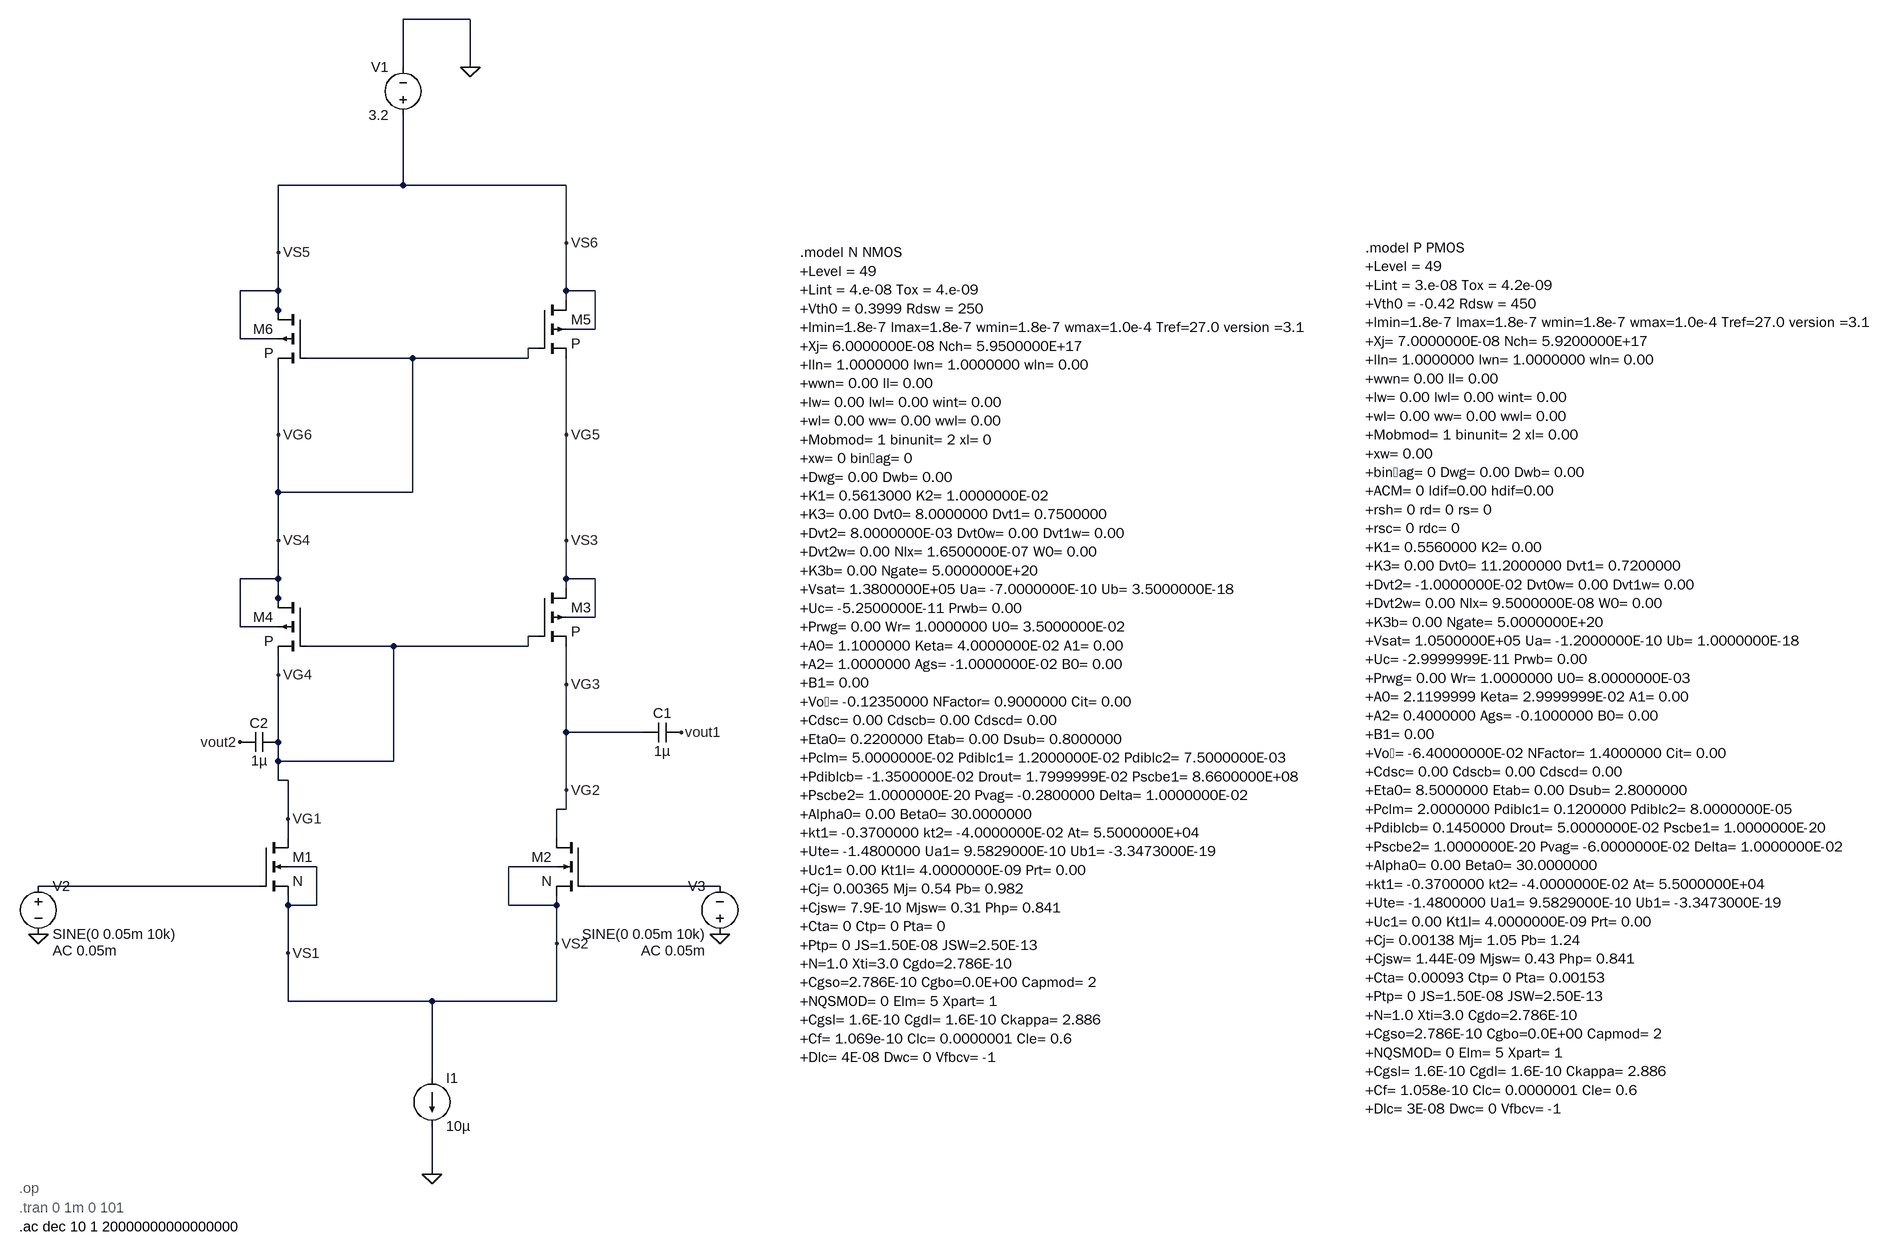
[diagram p0: schematic cascode.asc]
cascode.asc, the LTspice schematic file:
Version 4
SHEET 1 4308 1096
WIRE 1024 -976 912 -976
WIRE 912 -896 912 -976
WIRE 1024 -896 1024 -976
WIRE 912 -656 912 -816
WIRE 912 -656 704 -656
WIRE 1184 -656 912 -656
WIRE 1184 -560 1184 -656
WIRE 704 -544 704 -656
WIRE 704 -480 704 -544
WIRE 704 -480 640 -480
WIRE 1184 -480 1184 -560
WIRE 1232 -480 1184 -480
WIRE 1184 -464 1184 -480
WIRE 704 -448 704 -480
WIRE 704 -432 704 -448
WIRE 1232 -416 1232 -480
WIRE 1232 -416 1184 -416
WIRE 640 -400 640 -480
WIRE 704 -400 640 -400
WIRE 1136 -384 1120 -384
WIRE 928 -368 752 -368
WIRE 1120 -368 1120 -384
WIRE 1120 -368 928 -368
WIRE 704 -240 704 -352
WIRE 1184 -240 1184 -368
WIRE 704 -144 704 -240
WIRE 928 -144 928 -368
WIRE 928 -144 704 -144
WIRE 704 -64 704 -144
WIRE 1184 -64 1184 -240
WIRE 704 0 704 -64
WIRE 704 0 640 0
WIRE 1184 0 1184 -64
WIRE 1232 0 1184 0
WIRE 1184 16 1184 0
WIRE 704 32 704 0
WIRE 704 48 704 32
WIRE 1232 64 1232 0
WIRE 1232 64 1184 64
WIRE 640 80 640 0
WIRE 704 80 640 80
WIRE 1136 96 1120 96
WIRE 896 112 752 112
WIRE 1120 112 1120 96
WIRE 1120 112 896 112
WIRE 704 160 704 128
WIRE 1184 176 1184 112
WIRE 1184 256 1184 176
WIRE 1312 256 1184 256
WIRE 704 272 704 160
WIRE 704 304 704 272
WIRE 896 304 896 112
WIRE 896 304 704 304
WIRE 704 336 704 304
WIRE 720 336 704 336
WIRE 1184 352 1184 256
WIRE 1184 384 1184 352
WIRE 1184 384 1168 384
WIRE 720 400 720 336
WIRE 720 432 720 400
WIRE 1168 432 1168 384
WIRE 768 480 720 480
WIRE 1168 480 1088 480
WIRE 672 512 304 512
WIRE 1440 512 1216 512
WIRE 720 544 720 528
WIRE 768 544 768 480
WIRE 768 544 720 544
WIRE 1088 544 1088 480
WIRE 1168 544 1168 528
WIRE 1168 544 1088 544
WIRE 1168 608 1168 544
WIRE 720 624 720 544
WIRE 720 704 720 624
WIRE 960 704 720 704
WIRE 1168 704 1168 608
WIRE 1168 704 960 704
WIRE 960 832 960 704
WIRE 960 992 960 912
FLAG 960 992 0
FLAG 1024 -896 0
FLAG 304 592 0
FLAG 1440 592 0
FLAG 1376 256 vout1
FLAG 640 272 vout2
FLAG 720 400 VG1
FLAG 1184 352 VG2
FLAG 720 624 VS1
FLAG 1168 608 VS2
FLAG 1184 -64 VS3
FLAG 704 -64 VS4
FLAG 1184 176 VG3
FLAG 704 160 VG4
FLAG 704 -544 VS5
FLAG 1184 -560 VS6
FLAG 1184 -240 VG5
FLAG 704 -240 VG6
SYMBOL nmos4 672 432 R0
SYMATTR InstName M1
SYMATTR Value N
SYMATTR Value2 l=1u w=50u
SYMBOL nmos4 1216 432 M0
SYMATTR InstName M2
SYMATTR Value N
SYMATTR Value2 l=1u w=50u
SYMBOL pmos4 1136 16 R0
SYMATTR InstName M3
SYMATTR Value P
SYMATTR Value2 l=1u w=10u
SYMBOL pmos4 752 32 M0
SYMATTR InstName M4
SYMATTR Value P
SYMATTR Value2 l=1u w=10u
SYMBOL current 960 832 R0
WINDOW 123 0 0 Left 0
WINDOW 39 0 0 Left 0
SYMATTR InstName I1
SYMATTR Value 10µ
SYMBOL voltage 912 -800 R180
WINDOW 0 24 96 Left 2
WINDOW 3 24 16 Left 2
WINDOW 123 0 0 Left 0
WINDOW 39 0 0 Left 0
SYMATTR InstName V1
SYMATTR Value 3.2
SYMBOL cap 1376 240 R90
WINDOW 0 0 32 VBottom 2
WINDOW 3 32 32 VTop 2
SYMATTR InstName C1
SYMATTR Value 1µ
SYMBOL voltage 304 496 R0
WINDOW 123 24 124 Left 2
WINDOW 39 0 0 Left 0
SYMATTR Value2 AC 0.05m
SYMATTR InstName V2
SYMATTR Value SINE(0 0.05m 10k)
SYMBOL voltage 1440 608 R180
WINDOW 0 24 96 Left 2
WINDOW 3 24 16 Left 2
WINDOW 123 24 -12 Left 2
WINDOW 39 0 0 Left 0
SYMATTR InstName V3
SYMATTR Value SINE(0 0.05m 10k)
SYMATTR Value2 AC 0.05m
SYMBOL cap 704 256 R90
WINDOW 0 0 32 VBottom 2
WINDOW 3 32 32 VTop 2
SYMATTR InstName C2
SYMATTR Value 1µ
SYMBOL pmos4 1136 -464 R0
SYMATTR InstName M5
SYMATTR Value P
SYMATTR Value2 l=1u w=10u
SYMBOL pmos4 752 -448 M0
SYMATTR InstName M6
SYMATTR Value P
SYMATTR Value2 l=1u w=10u
TEXT 272 1016 Left 2 ;.op
TEXT 272 1048 Left 2 ;.tran 0 1m 0 101
TEXT 2304 -544 Left 2 !.model N NMOS\n+Level = 49\n+Lint = 4.e-08 Tox = 4.e-09\n+Vth0 = 0.3999 Rdsw = 250\n+lmin=1.8e-7 lmax=1.8e-7 wmin=1.8e-7 wmax=1.0e-4 Tref=27.0 version =3.1\n+Xj= 6.0000000E-08 Nch= 5.9500000E+17\n+lln= 1.0000000 lwn= 1.0000000 wln= 0.00\n+wwn= 0.00 ll= 0.00\n+lw= 0.00 lwl= 0.00 wint= 0.00\n+wl= 0.00 ww= 0.00 wwl= 0.00\n+Mobmod= 1 binunit= 2 xl= 0\n+xw= 0 binﬂag= 0\n+Dwg= 0.00 Dwb= 0.00\n+K1= 0.5613000 K2= 1.0000000E-02\n+K3= 0.00 Dvt0= 8.0000000 Dvt1= 0.7500000\n+Dvt2= 8.0000000E-03 Dvt0w= 0.00 Dvt1w= 0.00\n+Dvt2w= 0.00 Nlx= 1.6500000E-07 W0= 0.00\n+K3b= 0.00 Ngate= 5.0000000E+20\n+Vsat= 1.3800000E+05 Ua= -7.0000000E-10 Ub= 3.5000000E-18\n+Uc= -5.2500000E-11 Prwb= 0.00\n+Prwg= 0.00 Wr= 1.0000000 U0= 3.5000000E-02\n+A0= 1.1000000 Keta= 4.0000000E-02 A1= 0.00\n+A2= 1.0000000 Ags= -1.0000000E-02 B0= 0.00\n+B1= 0.00\n+Voﬀ= -0.12350000 NFactor= 0.9000000 Cit= 0.00\n+Cdsc= 0.00 Cdscb= 0.00 Cdscd= 0.00\n+Eta0= 0.2200000 Etab= 0.00 Dsub= 0.8000000\n+Pclm= 5.0000000E-02 Pdiblc1= 1.2000000E-02 Pdiblc2= 7.5000000E-03\n+Pdiblcb= -1.3500000E-02 Drout= 1.7999999E-02 Pscbe1= 8.6600000E+08\n+Pscbe2= 1.0000000E-20 Pvag= -0.2800000 Delta= 1.0000000E-02\n+Alpha0= 0.00 Beta0= 30.0000000\n+kt1= -0.3700000 kt2= -4.0000000E-02 At= 5.5000000E+04\n+Ute= -1.4800000 Ua1= 9.5829000E-10 Ub1= -3.3473000E-19\n+Uc1= 0.00 Kt1l= 4.0000000E-09 Prt= 0.00\n+Cj= 0.00365 Mj= 0.54 Pb= 0.982\n+Cjsw= 7.9E-10 Mjsw= 0.31 Php= 0.841\n+Cta= 0 Ctp= 0 Pta= 0\n+Ptp= 0 JS=1.50E-08 JSW=2.50E-13\n+N=1.0 Xti=3.0 Cgdo=2.786E-10\n+Cgso=2.786E-10 Cgbo=0.0E+00 Capmod= 2\n+NQSMOD= 0 Elm= 5 Xpart= 1\n+Cgsl= 1.6E-10 Cgdl= 1.6E-10 Ckappa= 2.886\n+Cf= 1.069e-10 Clc= 0.0000001 Cle= 0.6\n+Dlc= 4E-08 Dwc= 0 Vfbcv= -1
TEXT 3376 -552 Left 2 !.model P PMOS\n+Level = 49\n+Lint = 3.e-08 Tox = 4.2e-09\n+Vth0 = -0.42 Rdsw = 450\n+lmin=1.8e-7 lmax=1.8e-7 wmin=1.8e-7 wmax=1.0e-4 Tref=27.0 version =3.1\n+Xj= 7.0000000E-08 Nch= 5.9200000E+17\n+lln= 1.0000000 lwn= 1.0000000 wln= 0.00\n+wwn= 0.00 ll= 0.00\n+lw= 0.00 lwl= 0.00 wint= 0.00\n+wl= 0.00 ww= 0.00 wwl= 0.00\n+Mobmod= 1 binunit= 2 xl= 0.00\n+xw= 0.00\n+binﬂag= 0 Dwg= 0.00 Dwb= 0.00\n+ACM= 0 ldif=0.00 hdif=0.00\n+rsh= 0 rd= 0 rs= 0\n+rsc= 0 rdc= 0\n+K1= 0.5560000 K2= 0.00\n+K3= 0.00 Dvt0= 11.2000000 Dvt1= 0.7200000\n+Dvt2= -1.0000000E-02 Dvt0w= 0.00 Dvt1w= 0.00\n+Dvt2w= 0.00 Nlx= 9.5000000E-08 W0= 0.00\n+K3b= 0.00 Ngate= 5.0000000E+20\n+Vsat= 1.0500000E+05 Ua= -1.2000000E-10 Ub= 1.0000000E-18\n+Uc= -2.9999999E-11 Prwb= 0.00\n+Prwg= 0.00 Wr= 1.0000000 U0= 8.0000000E-03\n+A0= 2.1199999 Keta= 2.9999999E-02 A1= 0.00\n+A2= 0.4000000 Ags= -0.1000000 B0= 0.00\n+B1= 0.00\n+Voﬀ= -6.40000000E-02 NFactor= 1.4000000 Cit= 0.00\n+Cdsc= 0.00 Cdscb= 0.00 Cdscd= 0.00\n+Eta0= 8.5000000 Etab= 0.00 Dsub= 2.8000000\n+Pclm= 2.0000000 Pdiblc1= 0.1200000 Pdiblc2= 8.0000000E-05\n+Pdiblcb= 0.1450000 Drout= 5.0000000E-02 Pscbe1= 1.0000000E-20\n+Pscbe2= 1.0000000E-20 Pvag= -6.0000000E-02 Delta= 1.0000000E-02\n+Alpha0= 0.00 Beta0= 30.0000000\n+kt1= -0.3700000 kt2= -4.0000000E-02 At= 5.5000000E+04\n+Ute= -1.4800000 Ua1= 9.5829000E-10 Ub1= -3.3473000E-19\n+Uc1= 0.00 Kt1l= 4.0000000E-09 Prt= 0.00\n+Cj= 0.00138 Mj= 1.05 Pb= 1.24\n+Cjsw= 1.44E-09 Mjsw= 0.43 Php= 0.841\n+Cta= 0.00093 Ctp= 0 Pta= 0.00153\n+Ptp= 0 JS=1.50E-08 JSW=2.50E-13\n+N=1.0 Xti=3.0 Cgdo=2.786E-10\n+Cgso=2.786E-10 Cgbo=0.0E+00 Capmod= 2\n+NQSMOD= 0 Elm= 5 Xpart= 1\n+Cgsl= 1.6E-10 Cgdl= 1.6E-10 Ckappa= 2.886\n+Cf= 1.058e-10 Clc= 0.0000001 Cle= 0.6\n+Dlc= 3E-08 Dwc= 0 Vfbcv= -1
TEXT 272 1080 Left 2 !.ac dec 10 1 20000000000000000

The netlist it stands for:
* cascode.asc
M1 VG4 N001 VS2 VS2 N l=1u w=50u
M2 VG3 N002 VS2 VS2 N l=1u w=50u
M3 VG5 VG4 VG3 VG5 P l=1u w=10u
M4 VG6 VG4 VG4 VG6 P l=1u w=10u
I1 VS2 0 10µ
V1 VS6 0 3.2
C1 vout1 VG3 1µ
V2 N001 0 SINE(0 0.05m 10k) AC 0.05m
V3 0 N002 SINE(0 0.05m 10k) AC 0.05m
C2 VG4 vout2 1µ
M5 VS6 VG6 VG5 VS6 P l=1u w=10u
M6 VS6 VG6 VG6 VS6 P l=1u w=10u
.model NMOS NMOS
.model PMOS PMOS
.lib standard.mos
* .op
* .tran 0 1m 0 101
.model N NMOS
+Level = 49
+Lint = 4.e-08 Tox = 4.e-09
+Vth0 = 0.3999 Rdsw = 250
+lmin=1.8e-7 lmax=1.8e-7 wmin=1.8e-7 wmax=1.0e-4 Tref=27.0 version =3.1
+Xj= 6.0000000E-08 Nch= 5.9500000E+17
+lln= 1.0000000 lwn= 1.0000000 wln= 0.00
+wwn= 0.00 ll= 0.00
+lw= 0.00 lwl= 0.00 wint= 0.00
+wl= 0.00 ww= 0.00 wwl= 0.00
+Mobmod= 1 binunit= 2 xl= 0
+xw= 0 binﬂag= 0
+Dwg= 0.00 Dwb= 0.00
+K1= 0.5613000 K2= 1.0000000E-02
+K3= 0.00 Dvt0= 8.0000000 Dvt1= 0.7500000
+Dvt2= 8.0000000E-03 Dvt0w= 0.00 Dvt1w= 0.00
+Dvt2w= 0.00 Nlx= 1.6500000E-07 W0= 0.00
+K3b= 0.00 Ngate= 5.0000000E+20
+Vsat= 1.3800000E+05 Ua= -7.0000000E-10 Ub= 3.5000000E-18
+Uc= -5.2500000E-11 Prwb= 0.00
+Prwg= 0.00 Wr= 1.0000000 U0= 3.5000000E-02
+A0= 1.1000000 Keta= 4.0000000E-02 A1= 0.00
+A2= 1.0000000 Ags= -1.0000000E-02 B0= 0.00
+B1= 0.00
+Voﬀ= -0.12350000 NFactor= 0.9000000 Cit= 0.00
+Cdsc= 0.00 Cdscb= 0.00 Cdscd= 0.00
+Eta0= 0.2200000 Etab= 0.00 Dsub= 0.8000000
+Pclm= 5.0000000E-02 Pdiblc1= 1.2000000E-02 Pdiblc2= 7.5000000E-03
+Pdiblcb= -1.3500000E-02 Drout= 1.7999999E-02 Pscbe1= 8.6600000E+08
+Pscbe2= 1.0000000E-20 Pvag= -0.2800000 Delta= 1.0000000E-02
+Alpha0= 0.00 Beta0= 30.0000000
+kt1= -0.3700000 kt2= -4.0000000E-02 At= 5.5000000E+04
+Ute= -1.4800000 Ua1= 9.5829000E-10 Ub1= -3.3473000E-19
+Uc1= 0.00 Kt1l= 4.0000000E-09 Prt= 0.00
+Cj= 0.00365 Mj= 0.54 Pb= 0.982
+Cjsw= 7.9E-10 Mjsw= 0.31 Php= 0.841
+Cta= 0 Ctp= 0 Pta= 0
+Ptp= 0 JS=1.50E-08 JSW=2.50E-13
+N=1.0 Xti=3.0 Cgdo=2.786E-10
+Cgso=2.786E-10 Cgbo=0.0E+00 Capmod= 2
+NQSMOD= 0 Elm= 5 Xpart= 1
+Cgsl= 1.6E-10 Cgdl= 1.6E-10 Ckappa= 2.886
+Cf= 1.069e-10 Clc= 0.0000001 Cle= 0.6
+Dlc= 4E-08 Dwc= 0 Vfbcv= -1
.model P PMOS
+Level = 49
+Lint = 3.e-08 Tox = 4.2e-09
+Vth0 = -0.42 Rdsw = 450
+lmin=1.8e-7 lmax=1.8e-7 wmin=1.8e-7 wmax=1.0e-4 Tref=27.0 version =3.1
+Xj= 7.0000000E-08 Nch= 5.9200000E+17
+lln= 1.0000000 lwn= 1.0000000 wln= 0.00
+wwn= 0.00 ll= 0.00
+lw= 0.00 lwl= 0.00 wint= 0.00
+wl= 0.00 ww= 0.00 wwl= 0.00
+Mobmod= 1 binunit= 2 xl= 0.00
+xw= 0.00
+binﬂag= 0 Dwg= 0.00 Dwb= 0.00
+ACM= 0 ldif=0.00 hdif=0.00
+rsh= 0 rd= 0 rs= 0
+rsc= 0 rdc= 0
+K1= 0.5560000 K2= 0.00
+K3= 0.00 Dvt0= 11.2000000 Dvt1= 0.7200000
+Dvt2= -1.0000000E-02 Dvt0w= 0.00 Dvt1w= 0.00
+Dvt2w= 0.00 Nlx= 9.5000000E-08 W0= 0.00
+K3b= 0.00 Ngate= 5.0000000E+20
+Vsat= 1.0500000E+05 Ua= -1.2000000E-10 Ub= 1.0000000E-18
+Uc= -2.9999999E-11 Prwb= 0.00
+Prwg= 0.00 Wr= 1.0000000 U0= 8.0000000E-03
+A0= 2.1199999 Keta= 2.9999999E-02 A1= 0.00
+A2= 0.4000000 Ags= -0.1000000 B0= 0.00
+B1= 0.00
+Voﬀ= -6.40000000E-02 NFactor= 1.4000000 Cit= 0.00
+Cdsc= 0.00 Cdscb= 0.00 Cdscd= 0.00
+Eta0= 8.5000000 Etab= 0.00 Dsub= 2.8000000
+Pclm= 2.0000000 Pdiblc1= 0.1200000 Pdiblc2= 8.0000000E-05
+Pdiblcb= 0.1450000 Drout= 5.0000000E-02 Pscbe1= 1.0000000E-20
+Pscbe2= 1.0000000E-20 Pvag= -6.0000000E-02 Delta= 1.0000000E-02
+Alpha0= 0.00 Beta0= 30.0000000
+kt1= -0.3700000 kt2= -4.0000000E-02 At= 5.5000000E+04
+Ute= -1.4800000 Ua1= 9.5829000E-10 Ub1= -3.3473000E-19
+Uc1= 0.00 Kt1l= 4.0000000E-09 Prt= 0.00
+Cj= 0.00138 Mj= 1.05 Pb= 1.24
+Cjsw= 1.44E-09 Mjsw= 0.43 Php= 0.841
+Cta= 0.00093 Ctp= 0 Pta= 0.00153
+Ptp= 0 JS=1.50E-08 JSW=2.50E-13
+N=1.0 Xti=3.0 Cgdo=2.786E-10
+Cgso=2.786E-10 Cgbo=0.0E+00 Capmod= 2
+NQSMOD= 0 Elm= 5 Xpart= 1
+Cgsl= 1.6E-10 Cgdl= 1.6E-10 Ckappa= 2.886
+Cf= 1.058e-10 Clc= 0.0000001 Cle= 0.6
+Dlc= 3E-08 Dwc= 0 Vfbcv= -1
.ac dec 10 1 20000000000000000
.backanno
.end